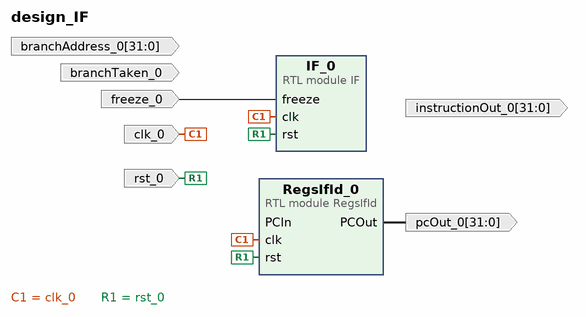
[diagram p0: block diagram of the top level]
# Vivado block design design_IF, xc7z010clg400-1, Vivado 2018.3
create_bd_design design_IF

create_bd_port -dir I -type clk clk_0
create_bd_port -dir I -type rst rst_0
create_bd_port -dir I branchTaken_0
create_bd_port -dir I freeze_0
create_bd_port -dir I -from 31 -to 0 branchAddress_0
create_bd_port -dir O -from 31 -to 0 pcOut_0
create_bd_port -dir O -from 31 -to 0 instructionOut_0

create_bd_cell -type module -reference RegsIfId RegsIfId_0
create_bd_cell -type module -reference IF IF_0

# ---- connections ----

connect_bd_net -net clk_0_1 [get_bd_ports clk_0] [get_bd_pins RegsIfId_0/clk] [get_bd_pins IF_0/clk]
connect_bd_net -net rst_0_1 [get_bd_ports rst_0] [get_bd_pins RegsIfId_0/rst] [get_bd_pins IF_0/rst]
# net branchTaken_0_1 has one end: branchTaken_0
connect_bd_net -net freeze_0_1 [get_bd_ports freeze_0] [get_bd_pins IF_0/freeze]
# net branchAddress_0_1 has one end: branchAddress_0
connect_bd_net -net RegsIfId_0 [get_bd_pins RegsIfId_0/PCOut] [get_bd_ports pcOut_0]
# net RegsIfId_0_instructionOut has one end: instructionOut_0
# net IF_0_PC has one end: RegsIfId_0/PCIn

validate_bd_design
save_bd_design
